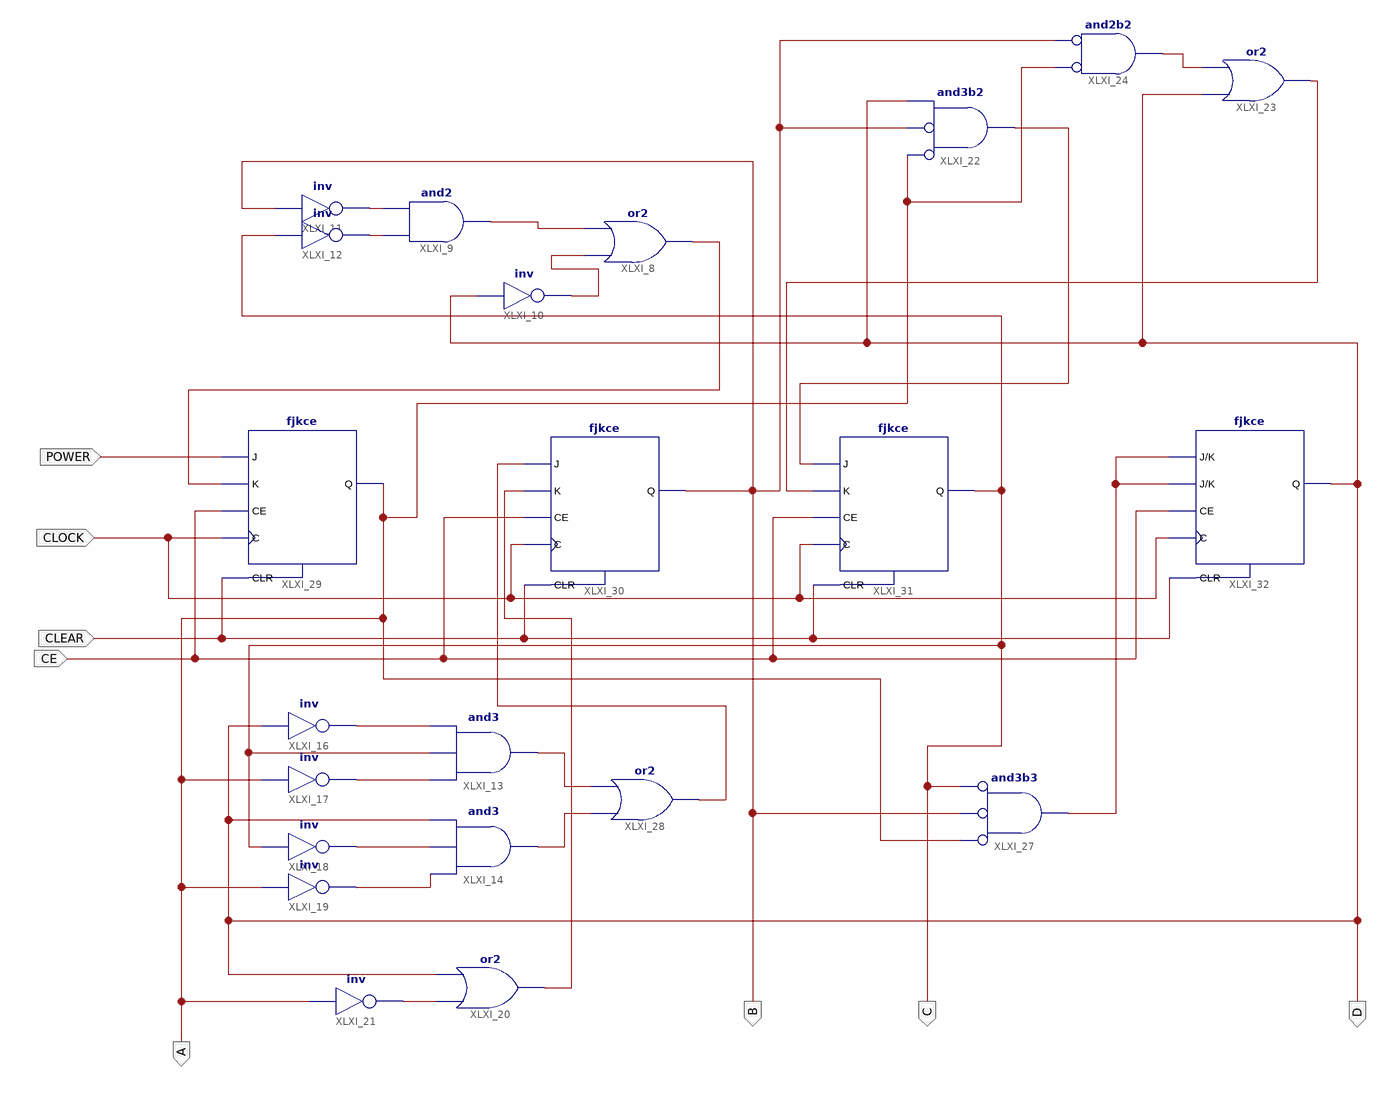
[diagram p0: schematic sheet 1]
// Xilinx ISE schematic decade_down_counter.sch (spartan3) as structural Verilog: 22 symbols, 8 ports
module decade_down_counter (
  input  CLOCK,
  input  POWER,
  input  CLEAR,
  input  CE,
  output C,
  output D,
  output B,
  output A
);

  wire XLXN_8, XLXN_10, XLXN_11, XLXN_15, XLXN_16, XLXN_17, XLXN_18, XLXN_19, XLXN_20, XLXN_21, XLXN_22,
       XLXN_28, XLXN_31, XLXN_32, XLXN_35, XLXN_36, XLXN_42, XLXN_46;

  or XLXI_8 (XLXN_15, XLXN_8, XLXN_28);
  and XLXI_9 (XLXN_28, XLXN_10, XLXN_11);
  not XLXI_10 (XLXN_8, D);
  not XLXI_11 (XLXN_11, B);
  not XLXI_12 (XLXN_10, C);
  and XLXI_13 (XLXN_16, XLXN_19, C, XLXN_18);
  and XLXI_14 (XLXN_17, XLXN_21, XLXN_20, D);
  not XLXI_16 (XLXN_18, D);
  not XLXI_17 (XLXN_19, A);
  not XLXI_18 (XLXN_20, C);
  not XLXI_19 (XLXN_21, A);
  or XLXI_20 (XLXN_32, XLXN_31, D);
  not XLXI_21 (XLXN_31, A);
  and XLXI_22 (XLXN_35, ~A, ~B, D);  // and3b2
  or XLXI_23 (XLXN_42, D, XLXN_36);
  and XLXI_24 (XLXN_36, ~A, ~B);  // and2b2
  and XLXI_27 (XLXN_46, ~A, ~B, ~C);  // and3b3
  or XLXI_28 (XLXN_22, XLXN_17, XLXN_16);
  fjkce XLXI_29 (.C(CLOCK), .CE(CE), .CLR(CLEAR), .J(POWER), .K(XLXN_15), .Q(A));
  fjkce XLXI_30 (.C(CLOCK), .CE(CE), .CLR(CLEAR), .J(XLXN_22), .K(XLXN_32), .Q(B));
  fjkce XLXI_31 (.C(CLOCK), .CE(CE), .CLR(CLEAR), .J(XLXN_35), .K(XLXN_42), .Q(C));
  fjkce XLXI_32 (.C(CLOCK), .CE(CE), .CLR(CLEAR), .J(XLXN_46), .K(XLXN_46), .Q(D));
endmodule
